# Altium schematic sheet Sheet1.SchDoc
size A; SheetNumber: 1; SheetTotal: 1
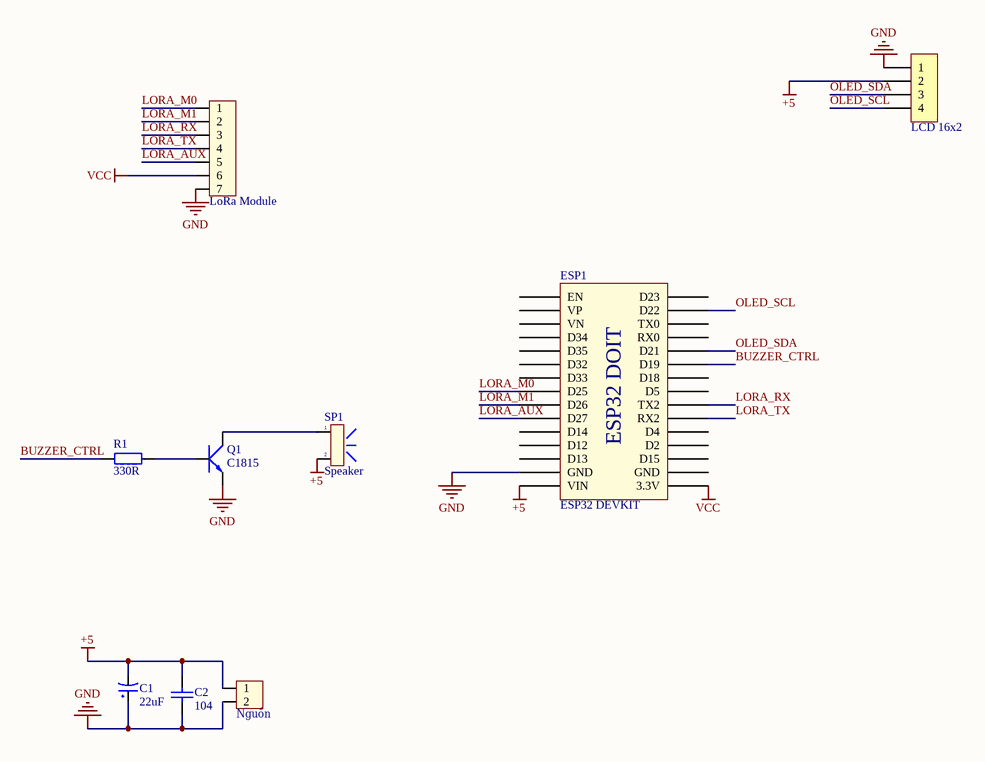
[diagram p0: Sheet1.SchDoc]

## Parts
C1  22uF  [tu hoa 4mm]
C2  104  [tu gom]
ESP1  ESP32 DEVKIT  [ESP32 WROOM 32 KIT]
H1  LCD 16x2  [Header 4P DC 2.54]
H2  LoRa Module  [Header 7P DC 2.54]
H3  Nguồn  [Header 2P DC 2.54]
Q1  C1815  [TO92]
R1  330R  [tro vach 1/4w]
SP1  Speaker  [SPK]

## Nets
+5: C1.2 C2.1 ESP1.15(VIN) H1.2 H3.1 SP1.2
GND: C1.1 C2.2 ESP1.14(GND) H1.1 H2.7 H3.2 Q1.1(E)
VCC: ESP1.16(3.3V) H2.6
BUZZER_CTRL: ESP1.25(D19) R1.1
LORA_AUX: ESP1.10(D27) H2.5
LORA_M0: ESP1.8(D25) H2.1
LORA_M1: ESP1.9(D26) H2.2
LORA_RX: ESP1.22(TX2) H2.3
LORA_TX: ESP1.21(RX2) H2.4
OLED_SCL: ESP1.29(D22) H1.4
OLED_SDA: ESP1.26(D21) H1.3
NetQ1_2: Q1.2(C) SP1.1
NetQ1_3: Q1.3(B) R1.2

Not connected (* = marked no-connect by the designer): ESP1 1(EN) 2(VP) 3(VN) 4(D34) 5(D35) 6(D32) 7(D33) 11(D14) 12(D12) 13(D13) 17(GND) 18(D15) 19(D2) 20(D4) 23(D5) 24(D18) 27(RX0) 28(TX0) 30(D23)

## Notes on the sheet
- (in symbol ESP32 WROOM 32 KIT) ESP32 DOIT

## Library data of the parts
C1 = Tu Hoa 22uF 16V 4x7: Cắm; Don_Vi: Con; So_Chan: 2; Ten_Linh_Kien: Tụ Hóa 22uF 16V; Ma_Hang: MH006857; Chung_Loai: Cắm; Kieu_Chan: *
C2 = Tu gom 104 50V: Cắm; So_Chan: 2; Ten_Linh_Kien: Tụ gốm 104 100nF 50V; Don_Vi: Con; Ma_Hang: MH004761; Chung_Loai: Cắm; Kieu_Chan: *
ESP1 = ESP32 WROOM 32 KIT
H1 = Header 4P 2.54 Duc Cong: Cắm; Ten_Linh_Kien: Header 4P XH2.54-4P Đực Cong; Don_Vi: Con; Ma_Hang: MH001310; Chung_Loai: Cắm
H2 = Header 7P 2.54 Duc Cong: Cắm; Ten_Linh_Kien: Header 7P XH2.54-7P Đực Cong; Don_Vi: Con; Ma_Hang: MH004118; Chung_Loai: Cắm
H3 = Header 2P 2.54 Duc Cong: Cắm; Ten_Linh_Kien: Header 2P XH2.54-2P Đực Cong; Don_Vi: Con; Ma_Hang: MH002852; Chung_Loai: Cắm
Q1 = Trans C1815 DIP: NPN transistor; Value: C9014
R1 = Tro Vach 1/4W 1% 330R: Cắm; Don_Vi: Con; So_Chan: 2; Ten_Linh_Kien: Trở Vạch 1/4w 1% 330R; Ma_Hang: MH006348; Chung_Loai: Cắm; Kieu_Chan: *
SP1 = SPK: Speaker Chip; Value: Speaker Chip